# EasyEDA schematic arquivo easy eda.json
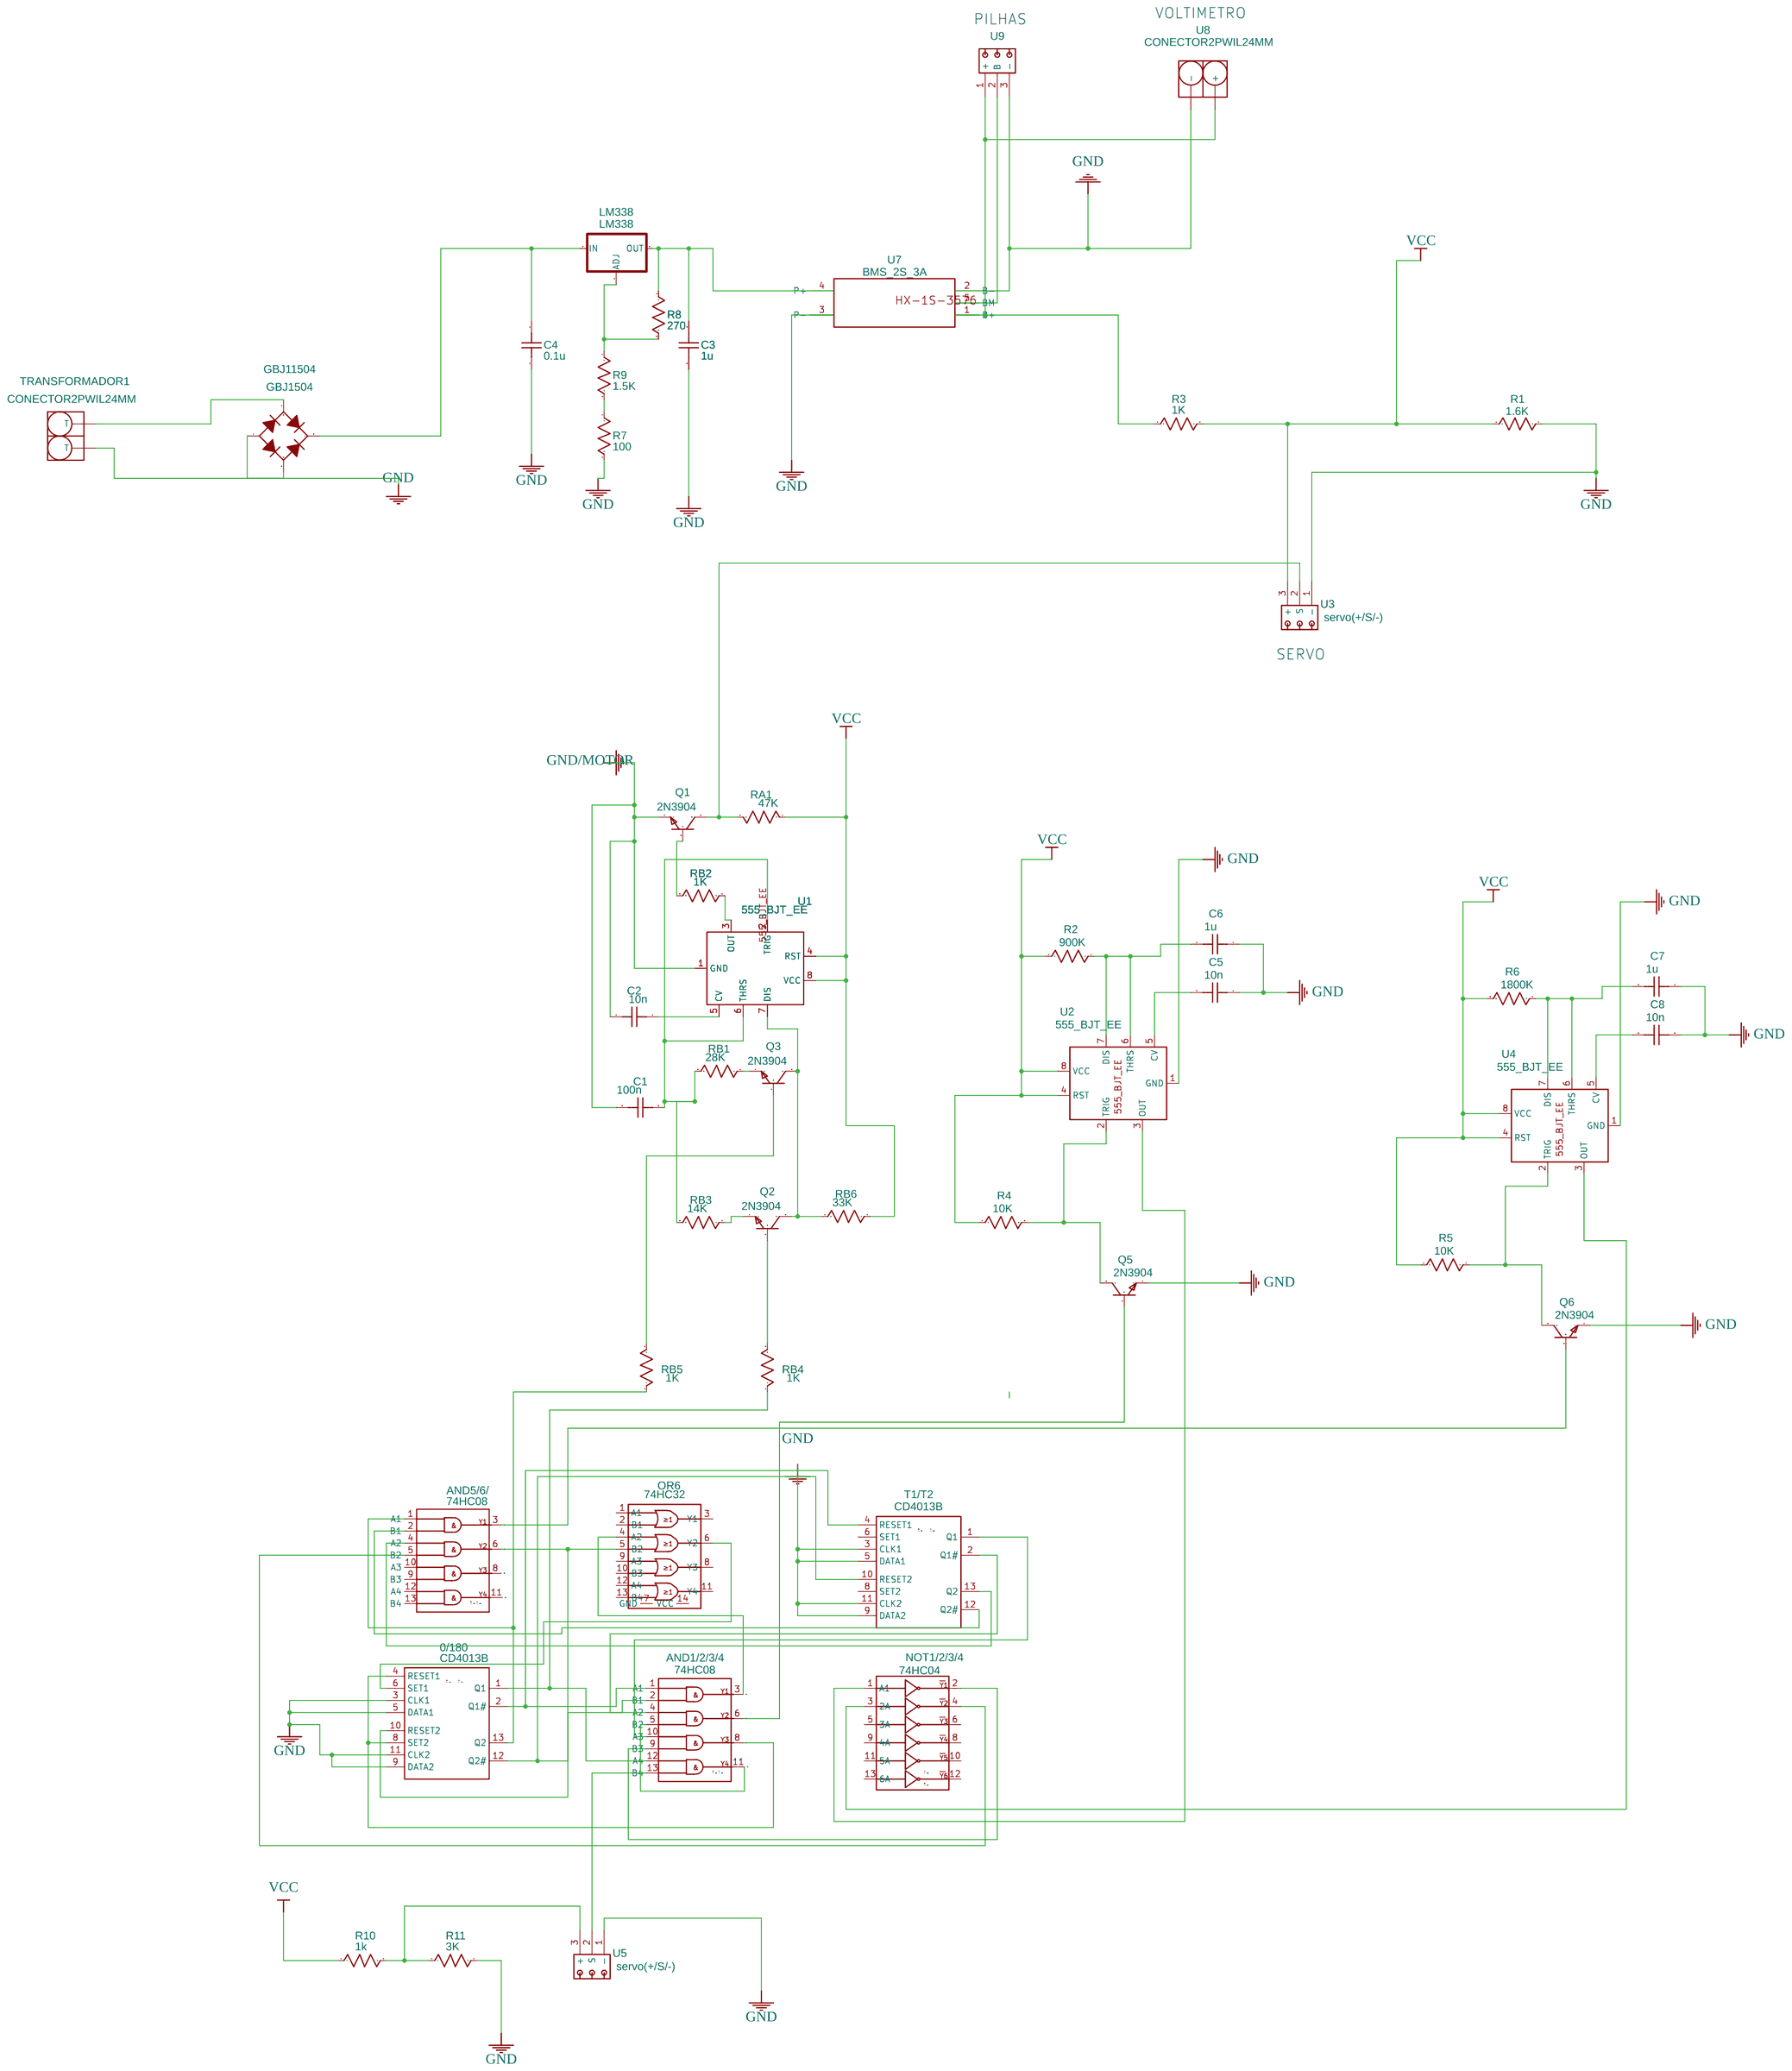
[diagram p0: schematic sheet]

## Parts
0/180  CD4013B  [SOP-14_L8.6-W3.9-P1.27-LS6.0-BL]
AND1/2/3/4  74HC08  [SOIC-14_L8.7-W3.9-P1.27-LS6.0-BL]
AND5/6/  74HC08  [SOIC-14_L8.7-W3.9-P1.27-LS6.0-BL]
C1  100n  [RAD-0.1]
C2  10n  [RAD-0.1]
C3  1u  [RAD-0.1]
C4  0.1u  [RAD-0.1]
C5  10n  [RAD-0.1]
C6  1u  [RAD-0.1]
C7  1u  [RAD-0.1]
C8  10n  [RAD-0.1]
GBJ11504  GBJ1504  [BRIDGE-GBJ]
LM338  LM338  [TO220]
NOT1/2/3/4  74HC04  [SOIC-14_L8.7-W3.9-P1.27-LS6.0-BL]
OR6  74HC32  [SOIC-14_L8.7-W3.9-P1.27-LS6.0-BL]
Q1  2N3904  [TO-92-3_L5.1-W4.1-P1.27-L]
Q2  2N3904  [TO-92-3_L5.1-W4.1-P1.27-L]
Q3  2N3904  [TO-92-3_L5.1-W4.1-P1.27-L]
Q5  2N3904  [TO-92-3_L5.1-W4.1-P1.27-L]
Q6  2N3904  [TO-92-3_L5.1-W4.1-P1.27-L-1]
R1  1.6K  [AXIAL-0.3]
R2  900K  [AXIAL-0.3]
R3  1K  [AXIAL-0.3]
R4  10K  [AXIAL-0.3]
R5  10K  [AXIAL-0.3]
R6  1800K  [AXIAL-0.3]
R7  100  [AXIAL-0.3]
R8  270  [AXIAL-0.3]
R9  1.5K  [AXIAL-0.3]
R10  1k  [R0603]
R11  3K  [R0603]
RA1  47K  [AXIAL-0.3]
RB1  28K  [AXIAL-0.3]
RB2  1K  [AXIAL-0.3]
RB3  14K  [AXIAL-0.3]
RB4  1K  [AXIAL-0.3]
RB5  1K  [AXIAL-0.3]
RB6  33K  [AXIAL-0.3]
T1/T2  CD4013B  [SOP-14_L8.6-W3.9-P1.27-LS6.0-BL]
TRANSFORMADOR1  CONECTOR2PWIL24MM  [CONECTOR2WIL2.54ML]
U1  555_BJT_EE  [DIP8]
U2  555_BJT_EE  [DIP8]
U3  servo(+/S/-)  [CONECTOR1X3]
U4  555_BJT_EE  [DIP8]
U5  servo(+/S/-)  [CONECTOR1X3]
U7  BMS_2S_3A  [BMS_2S_UPDATED]
U8  CONECTOR2PWIL24MM  [CONECTOR2WIL2.54ML]
U9  servo(+/S/-)  [CONECTOR1X3]

## Library data of the parts
0/180 T1/T2 = 4KHEF: catid: 20; Contributor: 立创EDA官方封装库; Supplier: LCSC; sim: true
AND1/2/3/4 AND5/6/ NOT1/2/3/4 = DIGITAL: catid: 20; Contributor: fox123; sim: true
C1 C2 C4 C5 C8 = Capacitor_US: Contributor: EasyEDA; Supplier: YUJING; Capacitance: 1u
C3 C6 C7 = Capacitor_US: Contributor: EasyEDA; Supplier: YUJING
GBJ11504 = GBJ1504: Contributor: EasyEDA
LM338 = LM338
OR6 = DIGITAL: catid: 20; Contributor: 立创EDA官方封装库; sim: true
Q1-Q3 Q5 Q6 = 2N3904: catid: 20; Contributor: 立创EDA官方封装库; 制造商: ON Semiconductor; Supplier: LCSC; Manufacturer: ON Semiconductor; Manufacturer Part: Transistors; sim: true
R1-R9 RA1 RB1-RB6 = Resistor_US: Resistance: 1k; Contributor: EasyEDA; Supplier: YUJING
R10 R11 = R_0603_US: Contributor: LCEDA_Lib
TRANSFORMADOR1 U8 = CONECTOR2PWIL24MM: Contributor: Wilsonperez; sim: true
U1 U2 U4 = 555_BJT_EE: Contributor: EasyEDA; link: http://www.ti.com/lit/ds/symlink/ne555.pdf
U3 U5 U9 = CONECTOR1X3: catid: 20; Contributor: rander; sim: true
U7 = BMS_2S: catid: 20; Contributor: Soham Chakraborty; Manufacturer Part: FDC-2S-2; link: https://www.aliexpress.com/item/1Pcs-2-S-3A-7-4V-8-4V-18650-Lithium-Battery-Charger-Board-Li-ion-Battery/32822717860.html

## Nets
GND: 0/180.3(CLK1) 0/180.5(DATA1) 0/180.9(DATA2) 0/180.11(CLK2) C3.1 C4.1 C5.1 C6.1 C7.1 C8.1 GBJ11504.4(-) Q5.1(E) Q6.1(E) R1.2 R7.2 R11.2 T1/T2.3(CLK1) T1/T2.5(DATA1) T1/T2.9(DATA2) T1/T2.11(CLK2) U2.1(GND) U3.1(-) U4.1(GND) U5.1(-) U7.2(B-) U7.3(P-) U8.2(-) U9.3(-)
VCC: R1.1 R2.2 R3.2 R4.1 R5.1 R6.2 R10.1 RA1.1 RB6.1 U1.4(RST) U1.8(VCC) U2.4(RST) U2.8(VCC) U3.3(+) U4.4(RST) U4.8(VCC)
GND/MOTOR: C1.1 C2.1 Q1.1(E) U1.1(GND)
Net-(0/180-1): 0/180.1(Q1) AND1/2/3/4.12(A4) RB4.1
Net-(0/180-2): 0/180.2(Q1#) AND1/2/3/4.1(A1) T1/T2.4(RESET1)
Net-(0/180-4): 0/180.4(RESET1) 0/180.8(SET2) AND1/2/3/4.8(Y3#)
Net-(0/180-6): 0/180.6(SET1) OR6.6(Y2)
Net-(0/180-10): 0/180.10(RESET2) AND5/6/.6(Y2#) OR6.5(B2)
Net-(0/180-12): 0/180.12(Q2#) AND1/2/3/4.2(B1) T1/T2.10(RESET2)
Net-(0/180-13): 0/180.13(Q2) AND5/6/.1(A1) RB5.1
Net-(AND1/2/3/4-3): AND1/2/3/4.3(Y1#) OR6.4(A2)
Net-(AND1/2/3/4-4): AND1/2/3/4.4(A2) T1/T2.2(Q1#)
Net-(AND1/2/3/4-5): AND1/2/3/4.5(B2) AND1/2/3/4.11(Y4#)
Net-(AND1/2/3/4-6): AND1/2/3/4.6(Y2#) Q5.2(B)
Net-(AND1/2/3/4-9): AND1/2/3/4.9(B3) NOT1/2/3/4.2(1Y#)
Net-(AND1/2/3/4-10): AND1/2/3/4.10(A3) T1/T2.1(Q1)
Net-(AND1/2/3/4-13): AND1/2/3/4.13(B4) U5.2(S)
Net-(AND5/6/-2): AND5/6/.2(B1) T1/T2.12(Q2#)
Net-(AND5/6/-3): AND5/6/.3(Y1#) Q6.2(B)
Net-(AND5/6/-4): AND5/6/.4(A2) T1/T2.13(Q2)
Net-(AND5/6/-5): AND5/6/.5(B2) NOT1/2/3/4.4(2Y#)
Net-(C1-2): C1.2 RB1.2 RB3.2 U1.2(TRIG) U1.6(THRS)
Net-(C2-2): C2.2 U1.5(CV)
Net-(C3-2): C3.2 LM338.2(OUT) R8.1 U7.4(P+)
Net-(C4-2): C4.2 GBJ11504.2(+) LM338.3(IN)
Net-(C5-2): C5.2 U2.5(CV)
Net-(C6-2): C6.2 R2.1 U2.6(THRS) U2.7(DIS)
Net-(C7-2): C7.2 R6.1 U4.6(THRS) U4.7(DIS)
Net-(C8-2): C8.2 U4.5(CV)
Net-(GBJ11504-1): GBJ11504.1(C1) TRANSFORMADOR1.1(T)
Net-(GBJ11504-3): GBJ11504.3(C2) TRANSFORMADOR1.2(T)
Net-(LM338-1): LM338.1(ADJ) R8.2 R9.1
Net-(NOT1/2/3/4-1): NOT1/2/3/4.1(A1) U2.3(OUT)
Net-(NOT1/2/3/4-3): NOT1/2/3/4.3(2A) U4.3(OUT)
Net-(Q1-2): Q1.2(B) RB2.2
Net-(Q1-3): Q1.3(C) RA1.2 U3.2(S)
Net-(Q2-1): Q2.1(E) RB3.1
Net-(Q2-2): Q2.2(B) RB4.2
Net-(Q2-3): Q2.3(C) Q3.3(C) RB6.2 U1.7(DIS)
Net-(Q3-1): Q3.1(E) RB1.1
Net-(Q3-2): Q3.2(B) RB5.2
Net-(Q5-3): Q5.3(C) R4.2 U2.2(TRIG)
Net-(Q6-3): Q6.3(C) R5.2 U4.2(TRIG)
Net-(R3-1): R3.1 U7.1(B+) U8.1(+) U9.1(+)
Net-(R7-1): R7.1 R9.2
Net-(R10-2): R10.2 R11.1 U5.3(+)
Net-(RB2-1): RB2.1 U1.3(OUT)
Net-(U7-5): U7.5(BM) U9.2(B)

Not connected (* = marked no-connect by the designer): 0/180 7(GND) 14(VCC); AND1/2/3/4 7(GND) 14(VCC); AND5/6/ 7(GND) 8(Y3#) 9(B3) 10(A3) 11(Y4#) 12(A4) 13(B4) 14(VCC); NOT1/2/3/4 5(3A) 6(3Y#) 7(GND) 8(4Y#) 9(4A) 10(5Y#) 11(5A) 12(6Y#) 13(6A) 14(VCC); OR6 1(A1) 2(B1) 3(Y1) 7(GND) 8(Y3) 9(A3) 10(B3) 11(Y4) 12(A4) 13(B4) 14(VCC); T1/T2 6(SET1) 7(GND) 8(SET2) 14(VCC)

## Notes on the sheet
- VOLTIMETRO
- PILHAS
- SERVO
